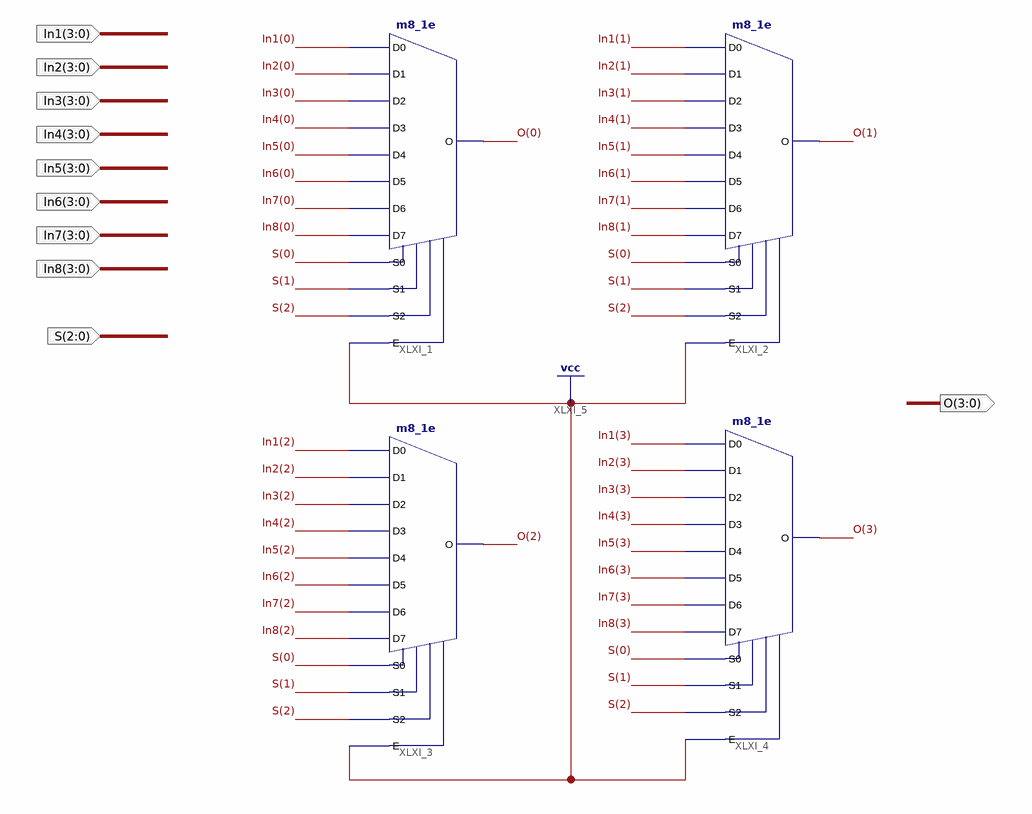
[diagram p0: schematic sheet 1]
// Xilinx ISE schematic mux4bit8to1.sch (spartan6) as structural Verilog: 4 symbols, 10 ports
module mux4bit8to1 (
  input  [3:0] In1,
  input  [3:0] In2,
  input  [3:0] In3,
  input  [3:0] In4,
  input  [3:0] In5,
  input  [3:0] In6,
  input  [3:0] In7,
  input  [3:0] In8,
  input  [2:0] S,
  output [3:0] O
);

  m8_1e XLXI_1 (
    .D0(In1[0]), .D1(In2[0]), .D2(In3[0]), .D3(In4[0]), .D4(In5[0]), .D5(In6[0]), .D6(In7[0]), .D7(In8[0]),
    .E(1'b1), .S0(S[0]), .S1(S[1]), .S2(S[2]), .O(O[0]));
  m8_1e XLXI_2 (
    .D0(In1[1]), .D1(In2[1]), .D2(In3[1]), .D3(In4[1]), .D4(In5[1]), .D5(In6[1]), .D6(In7[1]), .D7(In8[1]),
    .E(1'b1), .S0(S[0]), .S1(S[1]), .S2(S[2]), .O(O[1]));
  m8_1e XLXI_3 (
    .D0(In1[2]), .D1(In2[2]), .D2(In3[2]), .D3(In4[2]), .D4(In5[2]), .D5(In6[2]), .D6(In7[2]), .D7(In8[2]),
    .E(1'b1), .S0(S[0]), .S1(S[1]), .S2(S[2]), .O(O[2]));
  m8_1e XLXI_4 (
    .D0(In1[3]), .D1(In2[3]), .D2(In3[3]), .D3(In4[3]), .D4(In5[3]), .D5(In6[3]), .D6(In7[3]), .D7(In8[3]),
    .E(1'b1), .S0(S[0]), .S1(S[1]), .S2(S[2]), .O(O[3]));
endmodule
